# EAGLE board cloudArray2 (EAGLE 9.5.1), part 1 of 2
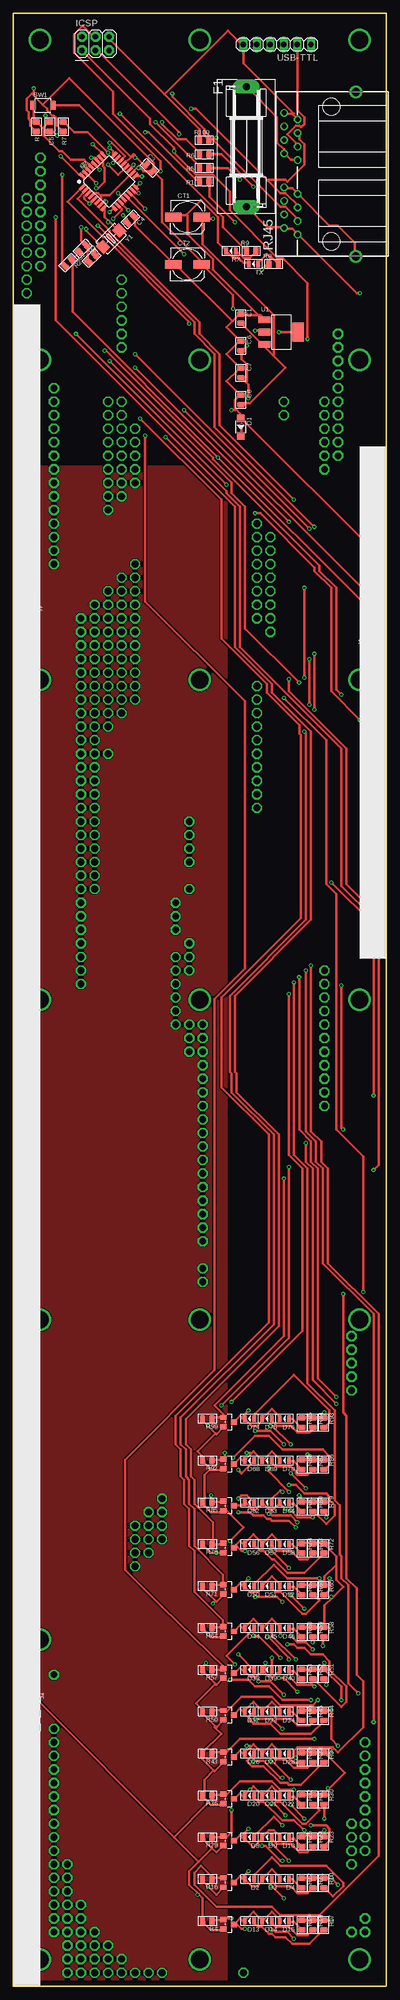
[diagram p13: board, top side]
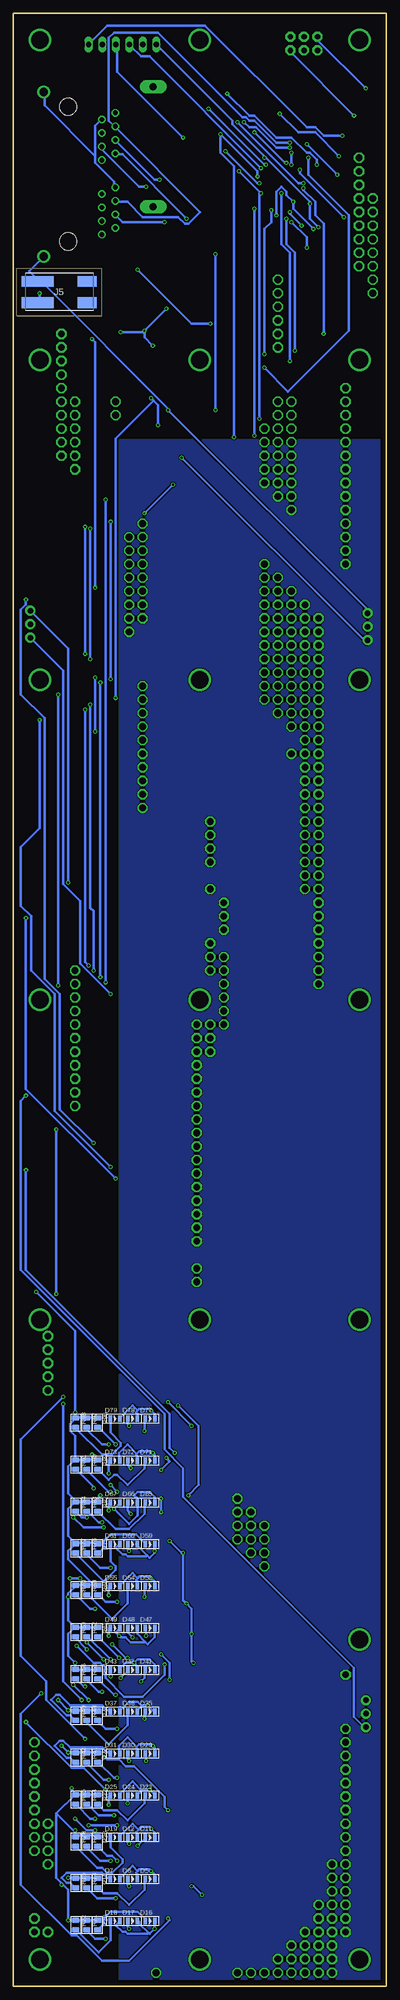
[diagram p14: board, bottom side, seen from below]

Size 70 x 370 mm. Coordinates in mm from the lower left corner, seen from the top.
Outline: 70,0 70,370 0,370 0,0 70,0
Copper layers (1*16): Top 0.035mm / dielectric 1.5mm / Bottom 0.035mm
Design rules "default *": minimum track width 6mil, minimum drill 0.35mm, track to track 6mil, track to pad 6mil, pad to pad 6mil, via to via 6mil, smd to smd 6mil, copper to edge 40mil, drill to drill 6mil, minimum pad ring 10mil, minimum via ring 8mil, stop-mask expansion 4mil, vias tented up to drill 14mil, thermal gap 10mil
Net classes: 0 default: width 0.508 mm

## Footprints (pad centres in the part's own frame; a part is rotated, then mirrored left to right if it is on the bottom)
C0805 = smd 1.397 x 1.016: 1 0,0.889; 2 0,-0.889
ELECTRO-SMD-C-6MM = smd 3.048 x 1.651: + 2.667,0; - -2.667,0
SOD-123 = smd 1.397 x 1.397: + -1.651,0; - 1.651,0
LED-0805 = smd 0.889 x 1.27: + -0.889,0; - 0.889,0
SH22,5A = drill 1.321 pad 2.54 long: 1 -11.252,0; 2 11.252,0
2X03 = drill 1.016 pad 1.88 octagon: 1 -2.54,-1.27; 2 -2.54,1.27; 3 0,-1.27; 4 0,1.27; 5 2.54,-1.27; 6 2.54,1.27
1X03 = drill 1.016 pad 1.88: 1 0,0; 2 2.54,0; 3 5.08,0
728340062 = smd 3.5 x 2: 1 -4.975,2; 3 -4.975,-2 | smd 6 x 2: 2 4.275,2; 4 4.275,-2
SOT-23 = smd 1.016 x 1.143: 1 -0.889,-1.016; 2 0.889,-1.016; 3 0,1.016
R0805 = smd 1.397 x 1.016: 1 0,0.889; 2 0,-0.889
557570-1 = drill 0.889: 1-1 -11.43,6.35; 1-2 -10.16,8.89; 1-3 -8.89,6.35; 1-4 -7.62,8.89; 1-5 -6.35,6.35; 1-6 -5.08,8.89; 1-7 -3.81,6.35; 1-8 -2.54,8.89; 2-1 2.54,6.35; 2-2 3.81,8.89; 2-3 5.08,6.35; 2-4 6.35,8.89; 2-5 7.62,6.35; 2-6 8.89,8.89; 2-7 10.16,6.35; 2-8 11.43,8.89 | drill 1.575 pad 2.184: G1 -15.494,-4.572; G3 15.367,-4.572 | hole 3.251: -12.7,0; 12.573,0
SW2-2.6-3.0X2.5X1.2+0.4MM = smd 1 x 1.7: 1 -1.9,0; 2 1.9,0
SOT-223 = smd 1.27 x 2.286: 1 -2.286,-3.175; 2 0,-3.175; 3 2.286,-3.175 | smd 3.556 x 2.159: TER 0,3.175
TQFP32-0.8-7X7MM = smd 1.27 x 0.559: 1 -4.293,2.8; 2 -4.293,2; 3 -4.293,1.2; 4 -4.293,0.4; 5 -4.293,-0.4; 6 -4.293,-1.2; 7 -4.293,-2; 8 -4.293,-2.8; 17 4.293,-2.8; 18 4.293,-2; 19 4.293,-1.2; 20 4.293,-0.4; 21 4.293,0.4; 22 4.293,1.2; 23 4.293,2; 24 4.293,2.8 | smd 0.559 x 1.27: 9 -2.8,-4.293; 10 -2,-4.293; 11 -1.2,-4.293; 12 -0.4,-4.293; 13 0.4,-4.293; 14 1.2,-4.293; 15 2,-4.293; 16 2.8,-4.293; 25 2.8,4.293; 26 2,4.293; 27 1.2,4.293; 28 0.4,4.293; 29 -0.4,4.293; 30 -1.2,4.293; 31 -2,4.293; 32 -2.8,4.293
1X06 = drill 1.016 long: 1 -6.35,0; 2 -3.81,0; 3 -1.27,0; 4 1.27,0; 5 3.81,0; 6 6.35,0
X2-SMD-5.0X3.2X1.3MM = smd 1.778 x 2.032: 1 -2.159,0; 2 2.159,0

## Placement (x,y rotation side)
C1  100nf  [C0805]  42.7,312.74 0 top
C2  18pf  [C0805]  14.71,324.05 135 top
C3  100nf  [C0805]  25.56,341 45 top
C4  18pf  [C0805]  22,331.35 315 top
C5  100nf  [C0805]  6.84,348.73 0 top
C6  100nf  [C0805]  42.7,307.66 0 top
C7  1uf  [C0805]  42.7,302.58 0 top
C8  1uf  [C0805]  42.7,297.5 0 top
CT1  220UF  [ELECTRO-SMD-C-6MM]  32.7,331.79 0 top
CT2  220UF  [ELECTRO-SMD-C-6MM]  32.7,322.9 0 top
D1  CESD5V0D1  [SOD-123]  42.7,292.42 270 top
D2  YELLOW-0805  [LED-0805]  44.29,20.07 180 top
D3  YELLOW-0805  [LED-0805]  47.59,20.07 180 top
D4  YELLOW-0805  [LED-0805]  50.89,20.07 180 top
D5  YELLOW-0805  [LED-0805]  44.29,20.07 0 bottom
D6  YELLOW-0805  [LED-0805]  47.59,20.07 0 bottom
D7  YELLOW-0805  [LED-0805]  50.89,20.07 0 bottom
D8  YELLOW-0805  [LED-0805]  44.29,27.92 180 top
D9  YELLOW-0805  [LED-0805]  47.59,27.92 180 top
D10  YELLOW-0805  [LED-0805]  50.89,27.92 180 top
D11  YELLOW-0805  [LED-0805]  44.29,27.92 0 bottom
D12  YELLOW-0805  [LED-0805]  47.59,27.92 0 bottom
D13  YELLOW-0805  [LED-0805]  44.29,12.22 180 top
D14  YELLOW-0805  [LED-0805]  47.59,12.22 180 top
D15  YELLOW-0805  [LED-0805]  50.89,12.22 180 top
D16  YELLOW-0805  [LED-0805]  44.29,12.22 0 bottom
D17  YELLOW-0805  [LED-0805]  47.59,12.22 0 bottom
D18  YELLOW-0805  [LED-0805]  50.89,12.22 0 bottom
D19  YELLOW-0805  [LED-0805]  50.89,27.92 0 bottom
D20  YELLOW-0805  [LED-0805]  44.29,35.77 180 top
D21  YELLOW-0805  [LED-0805]  47.59,35.77 180 top
D22  YELLOW-0805  [LED-0805]  50.89,35.77 180 top
D23  YELLOW-0805  [LED-0805]  44.29,35.77 0 bottom
D24  YELLOW-0805  [LED-0805]  47.59,35.77 0 bottom
D25  YELLOW-0805  [LED-0805]  50.89,35.77 0 bottom
D26  YELLOW-0805  [LED-0805]  44.29,43.62 180 top
D27  YELLOW-0805  [LED-0805]  47.59,43.62 180 top
D28  YELLOW-0805  [LED-0805]  50.89,43.62 180 top
D29  YELLOW-0805  [LED-0805]  44.29,43.62 0 bottom
D30  YELLOW-0805  [LED-0805]  47.59,43.62 0 bottom
D31  YELLOW-0805  [LED-0805]  50.89,43.62 0 bottom
D32  YELLOW-0805  [LED-0805]  44.29,51.47 180 top
D33  YELLOW-0805  [LED-0805]  47.59,51.47 180 top
D34  YELLOW-0805  [LED-0805]  50.89,51.47 180 top
D35  YELLOW-0805  [LED-0805]  44.29,51.47 0 bottom
D36  YELLOW-0805  [LED-0805]  47.59,51.47 0 bottom
D37  YELLOW-0805  [LED-0805]  50.89,51.47 0 bottom
D38  YELLOW-0805  [LED-0805]  44.29,59.32 180 top
D39  YELLOW-0805  [LED-0805]  47.59,59.32 180 top
D40  YELLOW-0805  [LED-0805]  50.89,59.32 180 top
D41  YELLOW-0805  [LED-0805]  44.29,59.32 0 bottom
D42  YELLOW-0805  [LED-0805]  47.59,59.32 0 bottom
D43  YELLOW-0805  [LED-0805]  50.89,59.32 0 bottom
D44  YELLOW-0805  [LED-0805]  44.29,67.17 180 top
D45  YELLOW-0805  [LED-0805]  47.59,67.17 180 top
D46  YELLOW-0805  [LED-0805]  50.89,67.17 180 top
D47  YELLOW-0805  [LED-0805]  44.29,67.17 0 bottom
D48  YELLOW-0805  [LED-0805]  47.59,67.17 0 bottom
D49  YELLOW-0805  [LED-0805]  50.89,67.17 0 bottom
D50  YELLOW-0805  [LED-0805]  44.29,75.02 180 top
D51  YELLOW-0805  [LED-0805]  47.59,75.02 180 top
D52  YELLOW-0805  [LED-0805]  50.89,75.02 180 top
D53  YELLOW-0805  [LED-0805]  44.29,75.02 0 bottom
D54  YELLOW-0805  [LED-0805]  47.59,75.02 0 bottom
D55  YELLOW-0805  [LED-0805]  50.89,75.02 0 bottom
D56  YELLOW-0805  [LED-0805]  44.29,82.87 180 top
D57  YELLOW-0805  [LED-0805]  47.59,82.87 180 top
D58  YELLOW-0805  [LED-0805]  50.89,82.87 180 top
D59  YELLOW-0805  [LED-0805]  44.29,82.87 0 bottom
D60  YELLOW-0805  [LED-0805]  47.59,82.87 0 bottom
D61  YELLOW-0805  [LED-0805]  50.89,82.87 0 bottom
D62  YELLOW-0805  [LED-0805]  44.29,90.72 180 top
D63  YELLOW-0805  [LED-0805]  47.59,90.72 180 top
D64  YELLOW-0805  [LED-0805]  50.89,90.72 180 top
D65  YELLOW-0805  [LED-0805]  44.29,90.72 0 bottom
D66  YELLOW-0805  [LED-0805]  47.59,90.72 0 bottom
D67  YELLOW-0805  [LED-0805]  50.89,90.72 0 bottom
D68  YELLOW-0805  [LED-0805]  44.29,98.57 180 top
D69  YELLOW-0805  [LED-0805]  47.59,98.57 180 top
D70  YELLOW-0805  [LED-0805]  50.89,98.57 180 top
D71  YELLOW-0805  [LED-0805]  44.29,98.57 0 bottom
D72  YELLOW-0805  [LED-0805]  47.59,98.57 0 bottom
D73  YELLOW-0805  [LED-0805]  50.89,98.57 0 bottom
D74  YELLOW-0805  [LED-0805]  44.29,106.42 180 top
D75  YELLOW-0805  [LED-0805]  47.59,106.42 180 top
D76  YELLOW-0805  [LED-0805]  50.89,106.42 180 top
D77  YELLOW-0805  [LED-0805]  44.29,106.42 0 bottom
D78  YELLOW-0805  [LED-0805]  47.59,106.42 0 bottom
D79  YELLOW-0805  [LED-0805]  50.89,106.42 0 bottom
F1  [SH22,5A]  43.73,345 270 top
ICSP  [2X03]  15.44,364.34 0 top
J2  455-1750-1-ND  [1X03]  66.82,252.89 90 top
J3  455-1750-1-ND  [1X03]  3.48,257.5 270 top
J4  455-1750-1-ND  [1X03]  3.8,53.64 270 top
J5  7-2834006-2  [728340062]  61.12,317.74 180 bottom
Q1  2N7002  [SOT-23]  40.42,19.44 270 top
Q2  2N7002  [SOT-23]  40.42,11.59 270 top
Q3  2N7002  [SOT-23]  40.42,27.29 270 top
Q4  2N7002  [SOT-23]  40.42,35.14 270 top
Q5  2N7002  [SOT-23]  40.42,42.99 270 top
Q6  2N7002  [SOT-23]  40.42,50.84 270 top
Q7  2N7002  [SOT-23]  40.42,58.69 270 top
Q8  2N7002  [SOT-23]  40.42,66.54 270 top
Q9  2N7002  [SOT-23]  40.42,74.39 270 top
Q10  2N7002  [SOT-23]  40.42,82.24 270 top
Q11  2N7002  [SOT-23]  40.42,90.09 270 top
Q12  2N7002  [SOT-23]  40.42,97.94 270 top
Q13  2N7002  [SOT-23]  40.42,105.79 270 top
R  10K  [R0805]  4.3,348.73 0 top
R1  100  [R0805]  35.88,338.46 270 top
R2  200  [R0805]  10.32,323.22 315 top
R3  300  [R0805]  13.01,325.91 315 top
R4  4.7K  [R0805]  36.44,12.22 270 top
R5  100  [R0805]  35.88,341 270 top
R6  100  [R0805]  35.88,343.54 270 top
R7  100  [R0805]  9.38,348.73 0 top
R8  470  [R0805]  48.86,322.99 90 top
R9  470  [R0805]  44.64,325.44 90 top
R10  470  [R0805]  58.26,19.31 0 top
R11  470  [R0805]  56.23,19.31 0 top
R12  470  [R0805]  54.2,19.31 0 top
R13  270  [R0805]  54.2,19.31 0 bottom
R14  270  [R0805]  56.23,19.31 0 bottom
R15  270  [R0805]  58.26,19.31 0 bottom
R16  4.7K  [R0805]  36.44,20.07 270 top
R17  470  [R0805]  58.26,11.46 0 top
R18  470  [R0805]  56.23,11.46 0 top
R19  470  [R0805]  54.2,11.46 0 top
R20  270  [R0805]  54.2,11.46 0 bottom
R21  270  [R0805]  56.23,11.46 0 bottom
R22  270  [R0805]  58.26,11.46 0 bottom
R23  470  [R0805]  58.26,27.16 0 top
R24  470  [R0805]  56.23,27.16 0 top
R25  470  [R0805]  54.2,27.16 0 top
R26  270  [R0805]  54.2,27.16 0 bottom
R27  270  [R0805]  56.23,27.16 0 bottom
R28  270  [R0805]  58.26,27.16 0 bottom
R29  4.7K  [R0805]  36.44,27.92 270 top
R30  470  [R0805]  58.26,35.01 0 top
R31  470  [R0805]  56.23,35.01 0 top
R32  470  [R0805]  54.2,35.01 0 top
R33  270  [R0805]  54.2,35.01 0 bottom
R34  270  [R0805]  56.23,35.01 0 bottom
R35  270  [R0805]  58.26,35.01 0 bottom
R36  4.7K  [R0805]  36.44,35.77 270 top
R37  470  [R0805]  58.26,42.86 0 top
R38  470  [R0805]  56.23,42.86 0 top
R39  470  [R0805]  54.2,42.86 0 top
R40  270  [R0805]  54.2,42.86 0 bottom
R41  270  [R0805]  56.23,42.86 0 bottom
R42  270  [R0805]  58.26,42.86 0 bottom
R43  4.7K  [R0805]  36.44,43.62 270 top
R44  470  [R0805]  58.26,50.71 0 top
R45  470  [R0805]  56.23,50.71 0 top
R46  470  [R0805]  54.2,50.71 0 top
R47  270  [R0805]  54.2,50.71 0 bottom
R48  270  [R0805]  56.23,50.71 0 bottom
R49  270  [R0805]  58.26,50.71 0 bottom
R50  4.7K  [R0805]  36.44,51.47 270 top
R51  470  [R0805]  58.26,58.56 0 top
R52  470  [R0805]  56.23,58.56 0 top
R53  470  [R0805]  54.2,58.56 0 top
R54  270  [R0805]  54.2,58.56 0 bottom
R55  270  [R0805]  56.23,58.56 0 bottom
R56  270  [R0805]  58.26,58.56 0 bottom
R57  4.7K  [R0805]  36.44,59.32 270 top
R58  470  [R0805]  58.26,66.41 0 top
R59  470  [R0805]  56.23,66.41 0 top
R60  470  [R0805]  54.2,66.41 0 top
R61  270  [R0805]  54.2,66.41 0 bottom
R62  270  [R0805]  56.23,66.41 0 bottom
R63  270  [R0805]  58.26,66.41 0 bottom
R64  4.7K  [R0805]  36.44,67.17 270 top
R65  470  [R0805]  58.26,74.26 0 top
R66  470  [R0805]  56.23,74.26 0 top
R67  470  [R0805]  54.2,74.26 0 top
R68  270  [R0805]  54.2,74.26 0 bottom
R69  270  [R0805]  56.23,74.26 0 bottom
R70  270  [R0805]  58.26,74.26 0 bottom
R71  4.7K  [R0805]  36.44,75.02 270 top
R72  470  [R0805]  58.26,82.11 0 top
R73  470  [R0805]  56.23,82.11 0 top
R74  470  [R0805]  54.2,82.11 0 top
R75  270  [R0805]  54.2,82.11 0 bottom
R76  270  [R0805]  56.23,82.11 0 bottom
R77  270  [R0805]  58.26,82.11 0 bottom
R78  4.7K  [R0805]  36.44,82.87 270 top
R79  470  [R0805]  58.26,89.96 0 top
R80  470  [R0805]  56.23,89.96 0 top
R81  470  [R0805]  54.2,89.96 0 top
R82  270  [R0805]  54.2,89.96 0 bottom
R83  270  [R0805]  56.23,89.96 0 bottom
R84  270  [R0805]  58.26,89.96 0 bottom
R85  4.7K  [R0805]  36.44,90.72 270 top
R86  470  [R0805]  58.26,97.81 0 top
R87  470  [R0805]  56.23,97.81 0 top
R88  470  [R0805]  54.2,97.81 0 top
R89  270  [R0805]  54.2,97.81 0 bottom
R90  270  [R0805]  56.23,97.81 0 bottom
R91  270  [R0805]  58.26,97.81 0 bottom
R92  4.7K  [R0805]  36.44,98.57 270 top
R93  470  [R0805]  58.26,105.66 0 top
R94  470  [R0805]  56.23,105.66 0 top
R95  470  [R0805]  54.2,105.66 0 top
R96  270  [R0805]  54.2,105.66 0 bottom
R97  270  [R0805]  56.23,105.66 0 bottom
R98  270  [R0805]  58.26,105.66 0 bottom
R99  4.7K  [R0805]  36.44,106.42 270 top
R100  22k  [R0805]  35.88,346.2 90 top
RJ45  [557570-1]  59.72,339.92 90 top
RX  YELLOW-0805  [LED-0805]  40.83,325.44 180 top
SW1  B3U-1000P-2P-SMD  [SW2-2.6-3.0X2.5X1.2+0.4MM]  5.56,352.75 0 top
TX  YELLOW-0805  [LED-0805]  45.05,322.99 180 top
U1  CJT1117-5.0-SOT223  [SOT-223]  50.32,310.2 270 top
U2  ATMEGA328P-AU-TQFP32  [TQFP32-0.8-7X7MM]  17.94,338.46 45 top
USB-TTL  [1X06]  49.51,364.16 180 top
Y1  16MHZ  [X2-SMD-5.0X3.2X1.3MM]  18.35,327.75 225 top

## Tracks (layer width: path | path; a pad name or v marks a point on that pad's centre or on a via)
9V  (via drill 0.35)
  Top 0.508: RJ45.2-1 53.34,342.58 52.07,342.58 51.12,343.54 RJ45.2-2 50.8,343.85 50.8,344.49 49.53,345.76 49.53,350.52 43.81,356.24 F1.1 | 46.99,307.66 48.74,305.91 | 48.74,305.91 51.12,303.53 44.45,296.86 42.86,296.86 C8.2 | 46.99,307.66 42.86,311.79 C1.2 | 46.99,307.66 U1.3 | 35.56,331.47 35.56,326.71 48.9,313.37 48.9,306.07 48.74,305.91 | 35.56,331.47 35.56,331.79 CT1.+ 35.56,331.47 | 35.56,331.47 v37.47,331.47
  Bottom 0.508: v37.47,331.47 49.53,343.54 50.8,343.54 RJ45.2-2
9VSUPPLY  (via drill 0.35)
  Top 0.508: F1.2 43.81,333.69 47.62,329.88 50.8,329.88 RJ45.1-2 51.12,329.56 52.39,329.56 53.34,328.61 RJ45.1-1 53.66,328.3 64.45,317.5 v65.09,317.5
  Bottom 0.508: v65.09,317.5 65.09,315.91 J5.2
+5V  (via drill 0.35)
  Top 0.508: R46.1 54.29,51.75 56.2,51.75 R45.1 56.52,51.75 58.1,51.75 R49.1 58.42,51.75 v59.69,51.75 59.69,46.35 v60.96,45.09 | R32.1 54.29,35.88 56.2,35.88 R31.1 56.52,35.88 58.1,35.88 R35.1 58.42,36.2 59.21,36.99 | R39.1 54.29,43.81 56.2,43.81 R38.1 56.52,43.81 58.1,43.81 R42.1 58.42,43.81 59.05,43.18 | 59.21,36.99 62.23,40.01 59.05,43.18 | 59.05,43.18 v59.69,43.81 | R12.1 54.29,20.32 56.2,20.32 R11.1 56.52,20.32 58.1,20.32 R15.1 58.42,20.32 v59.69,20.32 v60.96,19.05 | R19.1 54.29,12.38 56.2,12.38 R18.1 56.52,12.38 58.1,12.38 R22.1 58.42,12.38 v59.69,12.38 | R25.1 54.29,28.26 56.2,28.26 R24.1 56.52,28.26 58.1,28.26 R28.1 58.42,28.26 v58.42,29.21 | v59.05,37.15 59.21,36.99 | R67.1 54.29,75.25 56.2,75.25 R66.1 56.52,75.25 58.1,75.25 R70.1 58.42,75.25 58.42,76.83 60.64,79.06 | R60.1 54.29,67.31 56.2,67.31 R59.1 56.52,67.31 58.1,67.31 R63.1 58.42,67.31 58.42,71.44 59.85,72.87 | R74.1 54.29,83.19 56.2,83.19 R73.1 56.52,83.19 58.1,83.19 R77.1 58.42,82.87 60.64,80.64 60.64,79.06 | 59.85,72.87 61.91,74.93 60.64,76.2 60.64,79.06 | 55.24,98.74 56.2,98.74 R87.1 56.52,98.74 58.1,98.74 R91.1 | 55.24,98.74 54.29,98.74 R88.1 | v55.24,99.69 55.24,98.74 | R95.1 54.29,106.68 56.2,106.68 R94.1 56.52,106.68 58.1,106.68 R98.1 58.42,106.68 v58.42,107.63 | R84.1 58.1,90.81 56.52,90.81 R80.1 56.2,90.81 54.29,90.81 R81.1 53.98,91.12 53.98,91.76 v53.66,92.08 | R53.1 54.29,59.37 56.2,59.37 R52.1 56.52,59.37 58.1,59.37 R56.1 | v58.42,60.64 58.42,59.69 R56.1 | v59.69,73.03 59.85,72.87 | v61.59,53.66 61.59,56.2 58.42,59.37 R56.1 | v42.86,292.74 42.86,290.83 D1.- | v44.13,297.81 44.13,300.36 43.66,300.83
  Top 0.508: 43.66,300.83 42.86,301.62 C7.2 | 42.86,306.7 42.86,305.12 43.81,304.17 43.81,300.99 43.66,300.83 | v45.4,310.51 46.99,310.51 U1.2 | 42.86,306.7 v43.81,307.66 | 42.86,306.7 C6.2 | v49.85,310.2 53.34,310.2 U1.TER | 5.56,352.9 6.35,352.11 6.35,351.79 7.3,350.84 7.62,350.84 8.26,350.2 8.26,348.93 9.21,347.98 R7.2 | 5.56,352.9 3.65,354.81 | 3.65,354.81 3.49,354.96 2.54,354.01 2.54,351.79 2.86,351.47 2.86,350.2 3.17,349.88 3.17,348.93 4.13,347.98 R.2 | v3.81,355.92 3.81,354.96 3.65,354.81 | 16.35,335.76 15.88,336.23 15.24,336.23 14.92,335.92 U2.4 | 16.35,335.76 16.51,335.6 16.51,335.28 15.88,334.64 U2.6 | 23.34,341.15 23.5,341.31 24.45,340.36 26.04,340.36 C3.2 | 23.34,341.15 22.54,340.36 U2.18 22.23,340.04 18.1,335.92 16.51,335.92 16.35,335.76 | C3.2 26.35,340.36 27.94,338.77 27.94,330.83 35.24,323.53 35.24,323.21 CT2.+ 35.56,322.9 41.27,317.18 v41.27,314.64 | v23.5,341 23.34,341.15 | 5.56,352.9 10.48,357.82 26.35,341.95 26.35,340.68 C3.2 | v65.72,130.18 65.72,155.57 60.64,160.66 60.64,204.79 58.74,206.69 58.74,233.68 v50.8,241.62
  Bottom 0.508: R46.1 54.29,51.75 56.2,51.75 R45.1 56.52,51.75 58.1,51.75 R49.1 58.42,51.75 v59.69,51.75 v61.59,53.66 | R39.1 54.29,43.81 56.2,43.81 R38.1 56.52,43.81 58.1,43.81 R42.1 58.42,43.81 v59.69,43.81 v60.96,45.09 | R12.1 54.29,20.32 56.2,20.32 R11.1 56.52,20.32 58.1,20.32 R15.1 58.42,20.32 v59.69,20.32 | R19.1 54.29,12.38 56.2,12.38 R18.1 56.52,12.38 58.1,12.38 R22.1 58.42,12.38 v59.69,12.38 59.69,18.1 60.8,19.21 | R32.1 54.29,35.88 56.2,35.88 R31.1 56.52,35.88 58.1,35.88 R35.1 | R25.1 54.29,28.26 56.2,28.26 R24.1 56.52,28.26 58.1,28.26 R28.1 58.42,28.26 58.42,28.89 | 58.42,28.89 61.75,32.23 | 61.75,32.23 61.91,32.38 58.42,35.88 R35.1 | 58.42,28.89 v58.42,29.21 | 60.8,19.21 61.91,20.32 61.91,32.07 61.75,32.23 | v60.96,19.05 60.8,19.21 | v59.05,37.15 59.05,36.83 58.42,36.2 R35.1 | 55.24,98.74 56.2,98.74 R87.1 56.52,98.74 58.1,98.74 R91.1 | 55.24,98.74 54.29,98.74 R88.1 | 55.24,98.74 v55.24,99.69 | R95.1 54.29,106.68 56.2,106.68 R94.1 56.52,106.68 58.1,106.68 R98.1 | R98.1 58.42,106.68 v58.42,107.63 58.42,122.87 v65.72,130.18 | R91.1 58.42,98.74 58.42,103.19 59.37,104.14 59.37,105.41 58.42,106.36 R98.1 | R84.1 58.1,90.81 56.52,90.81 R80.1 56.2,90.81 54.29,90.81 R81.1 53.98,91.12 54.29,91.44 v53.66,92.08 | R74.1 54.29,83.19 56.2,83.19 R73.1 56.52,83.19 58.1,83.19 R77.1 | 54.93,75.25 56.2,75.25 R66.1 56.52,75.25 58.1,75.25 R70.1 58.42,74.93 59.69,73.66 v59.69,73.03 59.69,68.58 58.42,67.31 R63.1 | 54.93,75.25 54.29,75.25 R67.1 | R60.1 54.29,67.31 56.2,67.31 R59.1 56.52,67.31 58.1,67.31 R63.1 | R53.1 54.29,59.37 56.2,59.37 R52.1 56.52,59.37 58.1,59.37 R56.1 58.42,59.69 v58.42,60.64 59.69,61.91 59.69,66.04 58.74,66.99 58.42,66.99 R63.1
  Bottom 0.508: 54.93,75.25 59.69,80.01 59.69,81.6 58.42,82.87 R77.1 | R84.1 58.42,90.81 59.69,89.53 59.69,84.45 58.42,83.19 R77.1 | R91.1 58.42,98.42 58.74,98.42 59.69,97.47 59.69,92.39 58.42,91.12 R84.1 | v42.86,292.74 42.86,296.55 43.66,297.34 | v44.13,297.81 43.66,297.34 | 45.4,310.2 45.4,309.25 v43.81,307.66 | 45.4,310.2 v49.85,310.2 | 45.4,310.2 v45.4,310.51 v41.27,314.64 | v3.81,355.92 12.7,364.81 12.7,365.44 ICSP.2 | v23.5,341 44.45,361.95 46.04,361.95 47.94,363.86 USB-TTL.4 | v50.8,241.62 50.8,290.19 43.66,297.34
A0  (via drill 0.35)
  Top 0.508: v18.73,341.95 19.68,342.9 U2.23 | v24.77,347.66 25.4,347.66 34.29,338.77 34.92,338.77 R1.2
  Bottom 0.508: v18.73,341.95 19.05,341.95 v24.77,347.66
A1  (via drill 0.35)
  Top 0.508: v18.1,344.81 18.73,344.17 18.73,343.54 U2.24 | v26.67,349.57 34.92,341.31 R5.2
  Bottom 0.508: v18.1,344.81 20.64,344.81 24.45,348.62 25.72,348.62 v26.67,349.57
AREF  (via drill 0.35)
  Top 0.508: v17.78,341.63 19.68,339.73 20.95,341 U2.20 | v17.78,343.85 13.97,347.66 11.43,347.66 9.53,349.57 R7.1
  Bottom 0.508: v17.78,343.85 v17.78,341.63
AUX1  (via drill 0.35)
  Top 0.508: v22.54,341.63 22.54,341.31 21.91,340.68 U2.19 | v33.34,352.11 34.29,352.11 47.78,338.61 | 47.78,338.61 50.16,336.23 51.12,336.23 53.66,333.69 RJ45.1-5 | RJ45.2-5 53.66,347.35 53.66,346.39 54.61,345.44 54.61,341.63 51.44,338.45 51.12,338.77 47.94,338.77 47.78,338.61
  Bottom 0.508: v22.54,341.63 22.86,341.63 v33.34,352.11
AUX2  (via drill 0.35)
  Top 0.508: v18.1,345.76 18.41,345.76 20.95,343.22 20.32,342.58 U2.22
  Bottom 0.508: v18.1,345.76 20.64,345.76 24.77,349.88 25.72,349.88 26.35,350.52 26.99,350.52 42.86,366.39 51.12,366.39 52.07,365.44 52.07,349.88 51.12,348.93 RJ45.2-6 50.8,348.62 34.92,332.74 37.15,330.52 37.78,330.52 39.05,331.79 45.72,331.79 48.58,334.64 50.8,334.64 RJ45.1-6
BCOPPER
  pour Bottom: 50,0 50,290 0,290 0,0
GND  (via drill 0.35)
  Top 0.508: Q10.2 39.37,81.28 v38.1,81.28 37.15,81.28 R78.2 | Q8.2 39.37,65.41 37.15,65.41 v36.51,66.04 35.88,66.67 35.88,66.99 35.56,67.31 R64.2 | 37.94,72.23 35.24,74.93 R71.2 | 37.94,72.23 38.1,72.07 39.37,73.34 Q9.2 | 37.94,72.23 v37.47,71.75 | 37.94,103.66 v36.51,105.09 35.24,106.36 R99.2 | 37.94,103.66 38.1,103.5 39.37,104.78 Q13.2 | 36.99,97 35.88,98.11 35.88,98.42 35.56,98.74 | 36.99,97 37.15,96.84 39.37,96.84 Q12.2 | 36.99,97 35.88,95.89 35.88,90.81 R85.2 35.56,90.81 35.88,90.49 35.88,90.17 37.15,88.9 39.37,88.9 Q11.2 39.69,89.22 40.01,89.22 43.18,86.04 v40.64,83.5 | 37.94,103.66 34.61,100.33 35.56,99.38 35.56,98.74 | 35.56,98.74 R92.2 | 36.67,34.45 35.88,35.24 35.88,35.56 35.56,35.88 R36.2 35.88,35.88 35.88,38.73 37.62,40.48 | 36.67,34.45 37.15,33.97 39.37,33.97 Q4.2 | 37.62,40.48 35.56,42.55 35.56,43.5 R43.2 35.56,43.81 39.05,47.31 37.78,48.58 37.94,48.74 | 37.62,40.48 37.78,40.32 39.37,41.91 Q5.2 | 37.94,56.67 35.88,58.74 35.88,59.05 35.56,59.37 | 37.94,56.67 38.1,56.52 39.37,57.78 Q7.2 | 37.94,48.74 35.24,51.44 R50.2 35.56,51.75 34.29,53.02 37.94,56.67 | 37.94,48.74 38.1,48.58 39.37,49.85 Q6.2 | Q1.2 39.37,18.41 38.1,17.14 v36.51,18.73 35.24,20 R16.2 | 35.56,12.38 35.88,12.06 35.88,11.75 37.15,10.48 39.37,10.48 Q2.2 | 37.31,25.88 35.88,27.3 35.88,27.62 35.56,27.94 R29.2 | 37.31,25.88 38.1,25.08 39.37,26.35 Q3.2 | 35.56,12.38 35.56,16.51 34.77,17.3 | 34.77,17.3 33.02,19.05 33.02,21.59 34.77,23.34 | 37.31,25.88 34.77,23.34 | 35.56,12.38 R4.2 | v34.61,17.14 34.77,17.3 | 34.77,23.34 30.16,27.94 | 30.16,27.94 4.45,53.66 3.81,53.66 J4.1 | 30.16,27.94 36.67,34.45 | v36.2,60.64 35.24,59.69 35.56,59.37
  Top 0.508: 35.56,59.37 R57.2 | 28.42,354.81 17.78,365.44 ICSP.6 | 28.42,354.81 34.92,348.3 34.92,346.39 R100.1 | 22.07,343.06 22.54,343.54 23.02,343.06 | 22.07,343.06 20.95,341.95 U2.21 | 23.02,343.06 24.77,341.31 C3.1 | 22.07,343.06 12.38,352.74 7.62,352.74 SW1.2 | U2.5 14.92,334.96 v14.29,334.33 13.34,335.28 13.34,335.6 13.97,336.23 U2.3 | C2.1 13.97,323.53 13.97,326.07 13.65,326.39 R3.1 13.34,326.71 12.7,327.34 v12.7,329.88 | RJ45.1-8 51.12,337.19 52.39,337.19 53.34,336.23 RJ45.1-7 53.66,335.92 59.37,330.2 60.96,330.2 64.14,327.02 64.14,324.49 RJ45.G1 | 52.55,351 53.34,350.2 RJ45.2-7 | 52.55,351 52.39,351.15 51.12,351.15 RJ45.2-8 | 52.55,351 52.7,351.15 43.18,360.68 43.18,363.86 USB-TTL.6 42.86,364.17 40.32,366.71 28.42,354.81 | v22.86,342.9 23.02,343.06 | TX.- 44.13,323.21 43.18,323.21 42.23,324.17 41.27,324.17 40.01,325.44 RX.- 39.69,325.75 38.42,327.02 38.42,331.79 35.24,334.96 32.54,332.26 | 32.54,332.26 32.38,332.11 30.16,332.11 CT1.- | C4.1 22.86,331.79 22.86,330.2 29.84,323.21 CT2.- 30.16,322.9 30.48,322.9 41.12,312.26 | 46.04,313.37 46.35,313.37 46.99,312.74 U1.1 | 46.04,313.37 42.86,313.37 C1.1 42.55,313.37 42.23,313.37 41.12,312.26 | 41.75,295.75 41.59,295.91 41.59,297.5 42.55,298.45 | 41.75,295.75 42.55,294.96 42.55,294.32 D1.+ 42.86,294 68.58,268.29 68.58,254.63 66.99,253.05 J2.1 | 42.55,298.45 40.01,300.99 42.23,303.21 42.55,303.21 C7.1 42.55,303.53 40.01,306.07 42.23,308.29 42.55,308.29 C6.1 42.55,308.61 40.01,311.15 41.12,312.26 | 42.55,298.45 C8.1 | v40.96,295.59 41.59,295.59 41.75,295.75 | 46.04,313.37 37.47,321.94 37.47,323.85 32.7,328.61 32.7,332.11 32.54,332.26
  Top 0.508: v40.96,109.54 54.29,122.87 54.29,153.35 51.75,155.89 v51.75,186.06
  Bottom 0.508: v40.64,83.5 38.42,81.28 v38.1,81.28 38.1,72.39 v37.47,71.75 36.51,70.8 v36.51,66.04 36.51,60.96 v36.2,60.64 | v36.51,18.73 36.2,18.73 v34.61,17.14 | RJ45.G1 64.45,324.17 66.99,321.63 65.41,320.04 J5.4 65.09,319.72 64.77,319.72 40.64,295.59 v40.96,295.59 3.49,258.13 3.49,257.81 J3.1 | v12.7,329.88 14.29,331.47 v14.29,334.33 14.29,334.64 22.7,343.06 | 54.61,343.22 54.61,348.93 53.66,349.88 RJ45.2-7 | 54.61,343.22 54.61,341.95 51.12,338.45 51.12,337.5 RJ45.1-8 | 54.61,343.22 64.14,352.74 64.14,355.28 RJ45.G3 | 22.7,343.06 28.89,349.25 28.89,349.88 42.86,363.86 USB-TTL.6 | v22.86,342.9 22.7,343.06 | v40.96,109.54 v36.51,105.09 | v51.75,186.06 57.47,191.77 57.47,203.52 60.64,206.69 60.64,246.7 66.67,252.73 J2.1
GREEN  (via drill 0.35)
  Top 0.508: v8.26,347.03 7.62,347.66 6.99,347.66 C5.2
  Bottom 0.508: v8.26,347.03 11.75,347.03 13.34,348.62 14.92,348.62 33.97,367.67 52.39,367.67 55.88,364.17 USB-TTL.1
LED1  (via drill 0.35)
  Top 0.508: R4.1 37.47,12.38 39.37,12.38 Q2.1 39.69,12.7 v40.96,12.7 | v52.7,278.76 38.73,292.74 38.73,306.07 34.92,309.88 34.92,312.1 18.1,328.93 18.1,329.25 12.06,335.28 13.34,336.55 U2.2 | v52.7,188.28 52.7,155.89 55.24,153.35 55.24,113.03 60.33,107.95 60.33,91.12 61.28,90.17 61.28,80.96 61.59,80.64 61.59,76.52 62.87,75.25 62.87,56.83 v64.77,54.93
  Bottom 0.508: v52.7,188.28 v52.7,278.76 | v64.77,54.93 68.58,51.12 68.58,19.05 59.05,9.53 58.1,9.53 53.34,4.76 48.26,4.76 40.64,12.38 v40.96,12.7
LED2  (via drill 0.35)
  Top 0.508: 37.47,20.32 39.37,20.32 Q1.1 | v18.1,332.74 18.73,333.38 U2.9 | v15.88,330.2 33.97,312.1 33.97,309.88 37.78,306.07 37.78,292.42 v56.52,273.69 | v56.52,239.4 v56.52,249.87 | v55.88,191.45 55.88,160.34 57.78,158.43 57.78,154.62 59.05,153.35 59.05,135.57 68.58,126.05 68.58,24.45 57.47,13.34 50.16,13.34 48.58,14.92 38.1,14.92 33.97,19.05 33.97,21.27 35.24,22.54 37.47,20.32 | 37.47,20.32 R16.1
  Bottom 0.508: v18.1,332.74 18.1,332.42 v15.88,330.2 | v56.52,249.87 v56.52,273.69 | v56.52,239.4 56.52,192.09 v55.88,191.45
LED3  (via drill 0.35)
  Top 0.508: R29.1 37.47,27.94 39.37,27.94 Q3.1 39.69,28.26 40.01,27.94 40.96,28.89 v40.96,33.02 | v18.73,331.47 20.32,333.06 20.32,333.38 19.68,334.01 U2.10 | v17.14,306.7 17.46,306.7 37.47,286.7 37.47,286.38 57.47,266.38 57.47,265.43 60.64,262.25 60.64,243.21 v61.59,242.25 | v61.59,187.64 61.59,160.97 v61.91,160.66 | v61.91,129.86 61.91,107.63 62.55,107 62.55,76.52 64.45,74.61 64.45,58.42 65.72,57.15 65.72,48.58 60.96,43.81 60.01,44.77 53.34,44.77 52.7,44.13 52.7,43.18 v53.02,42.86
  Bottom 0.508: v18.73,331.47 18.73,326.71 17.14,325.12 v17.14,306.7 | v61.59,187.64 v61.59,242.25 | v61.91,129.86 v61.91,160.66 | v53.02,42.86 52.7,42.86 52.39,42.55 50.16,42.55 48.9,41.27 47.31,41.27 41.59,35.56 41.59,33.66 v40.96,33.02
LED4  (via drill 0.35)
  Top 0.508: R36.1 37.47,35.88 39.37,35.88 Q4.1 39.69,36.2 40.01,35.88 42.55,38.42 48.58,38.42 50.16,36.83 v52.7,36.83 | v21.59,333.06 20.32,334.33 U2.11 | v55.56,273.37 v22.86,306.07 | v55.56,240.35 v55.56,248.92 | v54.93,190.5 54.93,160.34 56.83,158.43 56.83,154.62 58.1,153.35 58.1,135.57 67.63,126.05 v67.63,49.53
  Bottom 0.508: v21.59,333.06 21.59,330.83 22.86,329.56 v22.86,306.07 | v55.56,248.92 v55.56,273.37 | v55.56,240.35 55.56,202.25 54.93,201.61 v54.93,190.5 | v67.63,49.53 59.05,40.96 56.83,40.96 v52.7,36.83
LED5  (via drill 0.35)
  Top 0.508: R43.1 37.47,43.81 39.37,43.81 Q5.1 39.69,44.13 40.01,43.81 42.55,46.35 v56.52,46.35 | v19.68,336.23 20.64,335.28 U2.12 | v18.1,304.8 40.96,281.94 40.96,280.04 43.5,277.5 43.5,254.63 v53.66,244.47 | v53.66,189.23 53.66,160.66 55.88,158.43 55.88,154.62 57.15,153.35 57.15,113.98 v60.64,110.49
  Bottom 0.508: v19.68,336.23 19.68,326.71 18.1,325.12 v18.1,304.8 | v53.66,189.23 v53.66,244.47 | v60.64,110.49 68.58,102.55 68.58,61.91 63.82,57.15 63.82,53.66 v56.52,46.35
LED6  (via drill 0.35)
  Top 0.508: R50.1 37.47,51.75 39.37,51.75 Q6.1 39.69,51.75 40.01,51.44 42.86,54.29 48.58,54.29 50.16,52.7 56.2,52.7 v57.15,53.66 | v32.07,324.8 21.27,335.6 U2.13 | v67.63,260.03 v32.07,295.59 | v54.93,158.12 54.93,154.62 56.2,153.35 56.2,113.67 v60.64,109.22
  Bottom 0.508: v32.07,295.59 v32.07,324.8 | v67.63,260.03 67.63,259.08 68.58,258.13 68.58,242.25 64.14,237.81 64.14,188.91 61.28,186.06 61.28,164.47 v54.93,158.12 | v60.64,109.22 60.64,57.15 v57.15,53.66
LED7  (via drill 0.35)
  Top 0.508: R57.1 37.47,59.37 39.37,59.37 Q7.1 39.69,59.69 27.94,71.12 20.95,78.11 20.95,98.74 37.78,115.57 37.78,185.1 43.5,190.82 43.5,240.98 24.77,259.71 v24.77,290.83 | v24.77,333.38 21.91,336.23 U2.14
  Bottom 0.508: v24.77,290.83 v24.77,333.38
LED8  (via drill 0.35)
  Top 0.508: R64.1 37.47,67.31 39.37,67.31 Q8.1 39.37,67.63 39.37,68.58 33.97,73.98 33.97,81.6 33.02,82.55 33.02,89.53 32.07,90.49 32.07,94.93 31.43,95.57 31.43,100.65 30.48,101.6 30.48,107 47.94,124.46 47.94,159.7 39.05,168.59 39.05,185.42 53.98,200.34 53.98,234.63 53.66,234.95 53.66,236.54 47.62,242.57 47.62,244.16 39.05,252.73 39.05,278.76 v23.81,294 | v23.5,336.23 22.86,336.23 22.54,336.55 U2.15 | v27.62,340.36 27.62,342.26 18.73,351.15 18.73,355.28 11.43,362.58 11.43,366.08 13.02,367.67 15.24,365.44 ICSP.4
  Bottom 0.508: v27.62,340.36 v23.5,336.23 23.81,336.23 v23.81,294
LED9  (via drill 0.35)
  Top 0.508: R71.1 37.47,75.25 39.37,75.25 Q9.1 39.37,75.56 39.37,77.15 33.97,82.55 33.97,89.53 33.02,90.49 33.02,94.93 32.38,95.57 32.38,100.65 31.43,101.6 31.43,106.68 48.9,124.14 48.9,159.7 40.96,167.64 40.96,171.13 40.64,171.45 40.64,185.74 54.93,200.03 54.93,234.95 v54.61,235.27 | v23.81,338.14 23.18,337.5 U2.16 | ICSP.1 13.02,362.9 25.72,350.2 25.72,349.25 30.16,344.81 v30.16,344.17 30.16,343.85 34.29,339.73 37.47,339.73 40.64,336.55 40.64,333.06 49.53,324.17 50.48,324.17 55.24,319.4 v55.24,308.93 | v54.61,262.25 v54.61,245.43
  Bottom 0.508: v23.81,338.14 24.13,338.14 v30.16,344.17 | v54.61,245.43 v54.61,235.27 | v54.61,262.25 54.61,308.29 v55.24,308.93
LED10  (via drill 0.35)
  Top 0.508: Q10.1 39.37,82.87 37.47,82.87 R78.1 37.47,83.19 37.47,87 33.97,90.49 33.97,94.93 33.34,95.57 33.34,100.65 32.38,101.6 32.38,106.36 49.85,123.83 49.85,159.7 41.91,167.64 41.91,171.13 41.59,171.45 41.59,185.74 55.88,200.03 55.88,235.27 48.58,242.57 48.58,244.16 41.59,251.14 41.59,277.5 v28.57,290.51 | v24.13,339.41 23.18,339.41 U2.17 | v31.11,347.35 31.11,347.66 15.56,363.22 ICSP.3
  Bottom 0.508: v24.13,339.41 24.13,340.36 v31.11,347.35 31.11,343.85 28.57,341.31 v28.57,290.51
LED11  (via drill 0.35)
  Top 0.508: Q11.1 39.37,90.81 37.47,90.81 R85.1 37.15,90.81 v37.15,92.08 | v15.56,337.19 15.88,337.19 17.14,338.45 17.14,341 16.83,341.31 16.83,342.26 16.19,342.9 U2.26 | v40.01,281.62 v11.75,309.88 | v45.4,276.23 46.35,276.23 56.52,266.06 56.52,265.43 59.69,262.25 59.69,242.89 v65.09,237.49 | v51.75,153.67 51.75,121.6 v39.05,108.9
  Bottom 0.508: v15.56,337.19 15.56,336.87 13.34,334.64 13.34,332.11 11.75,330.52 v11.75,309.88 | v45.4,276.23 v40.01,281.62 | v65.09,237.49 65.09,217.17 68.58,213.68 68.58,202.56 66.67,200.66 66.67,190.5 62.23,186.06 62.23,164.15 v51.75,153.67 | v39.05,108.9 35.24,105.09 35.24,93.98 v37.15,92.08
LED12  (via drill 0.35)
  Top 0.508: R92.1 37.47,98.74 39.37,98.74 Q12.1 39.69,99.06 v39.69,100.01 | v14.61,342.9 15.24,342.9 15.56,342.58 U2.27 | v51.75,274.64 v22.86,303.53 | v51.75,245.11 51.75,242.89 62.55,232.09 62.55,206.69 68.58,200.66 68.58,153.99 v67.63,153.03
  Bottom 0.508: v14.61,342.9 14.61,339.73 6.99,332.11 6.99,310.51 18.41,299.08 v22.86,303.53 | v51.75,245.11 v51.75,274.64 | v67.63,153.03 67.63,134.3 40.64,107.31 40.64,100.97 v39.69,100.01
LED13  (via drill 0.35)
  Top 0.508: 39.37,106.68 37.47,106.68 R99.1 | v16.19,340.68 15.24,341.63 U2.28 | v7.94,331.79 7.94,312.42 40.01,280.35 40.01,280.04 42.55,277.5 42.55,251.14 61.59,232.09 61.59,206.38 v67.63,200.34 | v50.8,151.45 50.8,121.92 37.78,108.9 39.37,107.31 39.37,106.68 | 39.37,106.68 Q13.1
  Bottom 0.508: v16.19,340.68 16.19,340.04 v7.94,331.79 | v67.63,200.34 67.63,168.28 v50.8,151.45
N$1  (via drill 0.35)
  Top 0.508: D18.- 50.16,12.38 48.58,13.97 46.99,12.38 D17.- 46.67,12.38 45.09,13.97 43.5,12.38 D16.- 43.18,12.06 42.55,12.7 41.59,11.75 Q2.3 41.91,11.75 42.86,10.79 v43.5,10.79
  Bottom 0.508: 44.61,10 46.35,11.75 46.35,12.06 46.67,12.38 D17.- | 44.61,10 44.45,9.84 v43.5,10.79 43.5,12.06 D16.- | D18.- 50.16,12.06 50.8,11.43 49.53,10.16 48.9,10.16 48.58,9.84 44.77,9.84 44.61,10
N$2  (via drill 3.2 pad 4)
  other vias: 5,365
N$3  (via drill 0.35)
  Top 0.508: 17.94,330.99 19.68,329.25 Y1.1 | 17.94,330.99 17.14,331.79 17.14,333.38 U2.8 | v14.92,326.07 15.24,325.75 15.24,324.8 C2.2 | v17.78,330.83 17.94,330.99
  Bottom 0.508: v14.92,326.07 14.92,327.98 v17.78,330.83
N$4  (via drill 0.35)
  Top 0.508: v17.46,334.64 17.14,334.96 16.51,334.33 U2.7 | v13.65,329.56 13.65,329.25 16.51,326.39 Y1.2 | v20.64,332.11 21.27,331.47 21.27,330.83 C4.2
  Bottom 0.508: v13.65,329.56 17.46,333.38 v17.46,334.64 18.73,335.92 18.73,336.55 19.68,337.5 20.64,336.55 v20.64,332.11
N$5  (via drill 0.35)
  Top 0.508: v15.56,338.14 13.65,340.04 U2.31 | v27.94,349.57 27.94,349.25 30.8,346.39 32.38,346.39 34.92,343.85 R6.2
  Bottom 0.508: v15.56,338.14 16.51,338.14 v27.94,349.57
N$6  (via drill 3.2 pad 4)
  other vias: 35,365
N$7  (via drill 3.2 pad 4)
  other vias: 65,365
N$8  (via drill 3.2 pad 4)
  other vias: 65,305
N$9  (via drill 3.2 pad 4)
  other vias: 35,305
N$10  (via drill 3.2 pad 4)
  other vias: 5,305
N$11  (via drill 3.2 pad 4)
  other vias: 65,245
N$12  (via drill 3.2 pad 4)
  other vias: 35,245
N$13
  Top 0.508: R8.2 48.58,324.17 48.26,324.17 47.62,324.8 46.04,323.21 TX.+
N$14  (via drill 3.2 pad 4)
  other vias: 5,245
N$15  (via drill 3.2 pad 4)
  other vias: 65,185
N$16  (via drill 3.2 pad 4)
  other vias: 35,185
N$17  (via drill 0.35)
  Top 0.508: v42.23,96.84 42.86,96.2 45.09,98.42 D68.+ | v41.27,99.06 45.4,103.19 47.94,103.19 50.48,100.65 58.1,100.65 59.37,99.38 59.37,97.79 58.42,96.84 R86.2
  Bottom 0.508: v42.23,96.84 40.64,98.42 v41.27,99.06
N$18  (via drill 3.2 pad 4)
  other vias: 5,185
N$19  (via drill 3.2 pad 4)
  other vias: 65,125
N$20  (via drill 0.35)
  Top 0.508: R3.2 12.38,325.12 11.11,323.85 R2.1 11.11,323.53 11.11,314.01 v38.42,286.7 66.99,258.13 J2.3 | v67.63,167 67.63,199.07 v59.69,207.01
  Bottom 0.508: v38.42,286.7 4.13,252.41 3.49,252.41 J3.3 | v67.63,167 68.58,166.05 68.58,134.3 41.59,107.31 41.59,100.65 38.1,97.16 38.1,91.76 6.03,59.69 6.03,50.48 4.13,48.58 3.81,48.58 J4.3 | v59.69,207.01 59.69,250.82 66.67,257.81 J2.3
N$21  (via drill 3.2 pad 4)
  other vias: 35,125
N$22  (via drill 3.2 pad 4)
  other vias: 5,125
N$23  (via drill 1.27 pad 1.91)
  other vias: 45.72,271.78
N$24  (via drill 3.2 pad 4)
  other vias: 5,65
N$25  (via drill 3.2 pad 4)
  other vias: 65,5
N$26  (via drill 3.2 pad 4)
  other vias: 35,5
N$27  (via drill 3.2 pad 4)
  other vias: 5,5
N$28
  Top 0.508: D2.+ 45.4,20.32 45.4,20.95 48.58,24.13 50.16,22.54 58.74,22.54 61.91,19.37 61.91,18.73 60.01,16.83 58.42,18.41 R10.2
N$29
  Top 0.508: D3.+ 48.58,20 48.58,19.68 49.53,18.73 52.07,18.73 53.34,17.46 55.24,17.46 56.2,18.41 R11.2
N$30
  Top 0.508: RX.+ 41.91,325.44 43.18,324.17 44.45,324.17 45.72,325.44 R9.2
N$31
  Top 0.508: D4.+ 52.07,20 52.39,20 53.98,18.41 R12.2
N$32
  Bottom 0.508: D5.+ 45.4,20 45.4,18.1 48.26,15.24 50.48,17.46 53.02,17.46 53.98,18.41 R13.2
N$33  (via drill 0.35)
  Top 0.508: v48.26,18.73 48.58,18.73 v50.8,16.51
  Bottom 0.508: v48.26,18.73 48.58,19.05 48.58,20 D6.+ | v50.8,16.51 54.29,16.51 56.2,18.41 R14.2
N$34
  Bottom 0.508: D7.+ 52.07,20.32 52.39,20.32 53.34,21.27 60.01,21.27 60.96,20.32 60.01,19.37 59.37,19.37 58.42,18.41 R15.2
N$35  (via drill 0.35)
  Top 0.508: 42.86,20.32 43.18,20 D5.- 43.5,20 44.77,18.73 45.72,18.73 46.99,20 D6.- 46.99,20.32 48.58,21.91 50.16,20.32 D7.- | 42.86,20.32 42.55,20.64 41.59,19.68 Q1.3 | 42.86,20.32 v44.13,21.59
  Bottom 0.508: 46.67,21.59 46.99,21.27 46.67,20.95 46.67,20.32 D6.- | 46.67,21.59 46.35,21.91 44.45,21.91 v44.13,21.59 43.5,20.95 43.5,20.32 D5.- | 46.67,21.59 47.62,22.54 49.85,20.32 D7.-
N$36  (via drill 0.35)
  Top 0.508: v50.48,30.16 48.9,31.75 45.4,28.26 45.4,27.94 D8.+ | v55.88,30.16 58.74,30.16 59.37,29.53 59.37,27.3 58.42,26.35 R23.2
  Bottom 0.508: v55.88,30.16 v50.48,30.16
N$37
  Top 0.508: D9.+ 48.58,27.62 49.53,26.67 52.07,26.67 53.66,25.08 55.24,25.08 56.2,26.04 R24.2
N$38
  Top 0.508: D10.+ 52.07,27.62 52.7,27.62 53.98,26.35 R25.2
N$39  (via drill 0.35)
  Top 0.508: v46.67,26.35 47.31,26.35 50.16,23.5 v50.48,23.5
  Bottom 0.508: v46.67,26.35 45.4,27.62 D11.+ | v50.48,23.5 51.44,24.45 52.39,24.45 53.98,26.04 R26.2
N$40  (via drill 0.35)
  Top 0.508: v48.26,26.67 48.58,26.67 v51.75,23.5
  Bottom 0.508: v48.26,26.67 48.58,26.99 48.58,27.62 D12.+ | v51.75,23.5 53.66,23.5 56.2,26.04 R27.2
N$41
  Bottom 0.508: D19.+ 51.75,27.62 51.75,26.04 49.53,23.81 49.53,23.18 51.44,21.27 52.39,21.27 53.34,22.23 54.29,22.23 58.1,26.04 R28.2
N$42  (via drill 0.35)
  Top 0.508: 42.7,28.1 43.18,27.62 D11.- 43.5,27.62 45.09,26.04 46.67,27.62 D12.- 46.67,27.94 47.94,29.21 48.9,29.21 49.85,28.26 49.85,27.94 D19.- | 42.7,28.1 42.55,28.26 41.59,27.3 Q3.3 | 42.7,28.1 v44.13,29.53
  Bottom 0.508: 46.51,29.37 46.99,28.89 46.67,28.57 46.67,27.94 D12.- | 46.51,29.37 46.04,29.84 44.45,29.84 v44.13,29.53 43.5,28.89 43.5,27.94 D11.- | 46.51,29.37 47.62,30.48 49.85,28.26 49.85,27.94 D19.-
N$43  (via drill 0.35)
  Top 0.508: v54.61,29.21 52.7,31.11 50.48,31.11 46.99,34.61 46.04,34.61 45.4,35.24 45.4,35.56 D20.+ | v58.42,31.43 58.42,33.97 R30.2
  Bottom 0.508: v54.61,29.21 56.2,29.21 v58.42,31.43
N$44
  Top 0.508: D21.+ 48.58,35.56 49.53,34.61 50.16,34.61 54.29,30.48 54.93,30.48 57.47,33.02 56.52,33.97 R31.2
N$45
  Top 0.508: D22.+ 52.07,35.56 52.7,35.56 53.98,34.29 R32.2
N$46
  Bottom 0.508: D23.+ 45.4,35.56 45.4,34.29 48.58,31.11 50.48,33.02 53.02,33.02 53.98,33.97 R33.2
N$47  (via drill 0.35)
  Top 0.508: v48.58,34.29 48.9,34.29 v51.12,32.07
  Bottom 0.508: v48.58,34.29 48.58,35.56 D24.+ | v51.12,32.07 53.98,32.07 56.2,34.29 R34.2
N$48  (via drill 0.35)
  Top 0.508: v54.61,31.43 v52.07,33.97
  Bottom 0.508: v52.07,33.97 52.07,35.56 D25.+ | v54.61,31.43 55.56,31.43 58.1,33.97 R35.2
N$49  (via drill 0.35)
  Top 0.508: Q4.3 41.59,35.24 42.55,36.2 43.18,35.56 D23.- 43.5,35.88 v44.45,36.83 45.09,37.47 46.67,35.88 D24.- 46.99,35.88 48.58,37.47 50.16,35.88 D25.-
  Bottom 0.508: 45.88,36.67 46.67,35.88 D24.- | 45.88,36.67 45.72,36.83 v44.45,36.83 43.5,35.88 D23.- | 45.88,36.67 47.62,38.42 49.85,36.2 49.85,35.88 D25.-
N$50
  Top 0.508: D26.+ 45.09,43.5 43.81,42.23 44.77,41.27 46.99,41.27 50.16,38.1 51.44,38.1 51.75,37.78 53.98,37.78 58.1,41.91 R37.2
N$51
  Top 0.508: D27.+ 48.58,43.5 48.58,43.18 49.21,42.55 51.12,42.55 52.7,40.96 55.24,40.96 56.2,41.91 R38.2
N$52
  Top 0.508: D28.+ 51.75,43.5 51.75,42.86 52.7,41.91 53.98,41.91 R39.2
N$53  (via drill 0.35)
  Top 0.508: v45.09,42.23 46.99,42.23 50.16,39.05 v50.48,39.05
  Bottom 0.508: v45.09,42.23 45.09,43.5 D29.+ | v50.48,39.05 51.12,39.05 53.98,41.91 R40.2
N$54  (via drill 0.35)
  Top 0.508: v48.26,42.23 48.58,42.23 v52.07,38.73
  Bottom 0.508: v48.26,42.23 48.58,42.55 48.58,43.5 D30.+ | v52.07,38.73 53.02,38.73 56.2,41.91 R41.2
N$55
  Bottom 0.508: D31.+ 52.07,43.81 52.39,43.81 53.34,44.77 59.37,44.77 60.64,46.04 61.28,46.04 62.23,45.09 60.01,42.86 59.37,42.86 58.42,41.91 R42.2
N$56  (via drill 0.35)
  Top 0.508: Q5.3 41.59,43.18 42.55,44.13 43.18,43.5 D29.- 43.5,43.81 44.61,44.93 | D31.- 50.16,43.81 48.58,45.4 46.99,43.81 D30.- 46.67,43.81 45.09,45.4 44.61,44.93 | v43.81,45.09 44.45,45.09 44.61,44.93
  Bottom 0.508: 46.83,44.93 46.99,44.77 46.67,44.45 46.67,43.81 D30.- | 46.83,44.93 46.35,45.4 44.13,45.4 v43.81,45.09 43.5,44.77 43.5,43.81 D29.- | 46.83,44.93 48.58,46.67 50.16,45.09 50.16,43.81 D31.-
N$57
  Top 0.508: D32.+ 45.09,51.44 44.13,50.48 44.45,50.16 44.45,49.85 45.09,49.21 48.26,49.21 50.16,47.31 55.88,47.31 58.1,49.53 R44.2
N$58
  Top 0.508: D33.+ 48.58,51.44 48.58,51.12 49.53,50.16 52.07,50.16 53.34,48.9 55.56,48.9 56.2,49.53 R45.2
N$59
  Top 0.508: D34.+ 52.07,51.44 52.39,51.44 53.98,49.85 R46.2
N$60  (via drill 0.35)
  Top 0.508: v45.4,50.16 48.58,50.16 v50.48,48.26
  Bottom 0.508: v45.4,50.16 45.4,51.44 D35.+ | v50.48,48.26 52.7,48.26 53.98,49.53 R47.2
N$61
  Bottom 0.508: D36.+ 48.58,51.44 48.58,48.9 52.07,45.4 56.2,49.53 R48.2
N$62
  Bottom 0.508: D37.+ 52.07,51.75 52.39,51.75 53.34,52.7 59.37,52.7 61.28,54.61 61.91,54.61 62.87,53.66 60.01,50.8 59.37,50.8 58.42,49.85 R49.2
N$63  (via drill 0.35)
  Top 0.508: Q6.3 41.59,51.12 42.55,52.07 43.18,51.44 D35.- 43.5,51.75 44.61,52.86 | D37.- 50.16,51.75 48.58,53.34 46.99,51.75 D36.- 46.67,51.75 45.09,53.34 44.61,52.86 | v44.77,52.7 44.61,52.86
  Bottom 0.508: 45.88,52.55 46.67,51.75 D36.- | 45.88,52.55 45.72,52.7 v44.77,52.7 43.81,51.75 43.5,51.75 D35.- | 45.88,52.55 46.67,53.34 48.26,53.34 49.85,51.75 D37.-
N$64  (via drill 0.35)
  Top 0.508: v42.23,62.23 45.09,59.37 D38.+ | v40.64,57.47 44.13,57.47 45.4,56.2 47.94,56.2 50.48,53.66 v55.88,53.66 | v58.74,56.52 58.74,57.15 58.42,57.47 R51.2
  Bottom 0.508: v42.23,62.23 40.64,60.64 v40.64,57.47 | v58.74,56.52 v55.88,53.66
N$65  (via drill 0.35)
  Top 0.508: v48.58,61.59 48.58,59.37 D39.+ | v51.44,64.14 52.7,64.14 53.34,63.5 54.61,63.5 55.88,62.23 58.1,62.23 59.37,60.96 59.37,59.37 62.55,56.2 62.55,53.34 61.59,52.39 56.52,57.47 R52.2
  Bottom 0.508: v48.58,61.59 48.9,61.59 v51.44,64.14
N$66
  Top 0.508: D40.+ 52.07,59.05 52.7,59.05 53.98,57.78 R53.2
N$67  (via drill 0.35)
  Top 0.508: v46.04,57.15 48.26,57.15 v50.8,54.61
  Bottom 0.508: v46.04,57.15 45.4,57.78 45.4,59.05 D41.+ | v50.8,54.61 51.12,54.61 53.98,57.47 R54.2
N$68  (via drill 0.35)
  Top 0.508: v49.85,57.78 50.8,57.78 v53.34,55.24
  Bottom 0.508: v49.85,57.78 48.58,59.05 D42.+ | v53.34,55.24 53.98,55.24 56.2,57.47 R55.2
N$69  (via drill 0.35)
  Top 0.508: v51.75,58.1 53.34,56.52 56.2,56.52 v56.52,56.2
  Bottom 0.508: v51.75,58.1 51.75,59.05 D43.+ | v56.52,56.2 56.83,56.2 58.1,57.47 R56.2
N$70  (via drill 0.35)
  Top 0.508: Q7.3 41.59,58.74 42.55,59.69 43.18,59.05 D41.- 43.5,59.05 44.45,58.1 45.09,58.1 45.4,57.78 46.67,59.05 D42.- 46.99,59.05 47.15,58.9 | 47.15,58.9 47.94,58.1 48.26,58.1 48.58,57.78 49.85,59.05 D43.- | v47.31,60.64 47.31,59.05 47.15,58.9
  Bottom 0.508: v47.31,60.64 46.67,61.28 44.45,61.28 43.5,60.33 43.5,59.37 D41.- | v47.31,60.64 46.67,60.01 46.67,59.37 D42.- | v47.31,60.64 47.62,60.96 47.94,60.64 48.9,60.64 49.85,59.69 49.85,59.37 D43.-
N$71  (via drill 0.35)
  Top 0.508: v41.59,60.33 40.01,61.91 45.09,66.99 D44.+ | v58.1,63.82 58.1,65.41 R58.2
  Bottom 0.508: v41.59,60.33 41.59,58.42 45.72,54.29 49.21,54.29 52.7,57.78 52.7,59.69 53.66,60.64 54.93,60.64 v58.1,63.82
N$72  (via drill 0.35)
  Top 0.508: v53.02,61.28 48.58,65.72 48.58,66.99 D45.+ | v56.2,64.45 56.2,65.41 R59.2
  Bottom 0.508: v56.2,64.45 v53.02,61.28
N$73
  Top 0.508: D46.+ 52.07,66.99 52.7,66.99 53.98,65.72 R60.2
N$74  (via drill 0.35)
  Top 0.508: v45.09,65.72 46.04,65.72 v50.16,61.59
  Bottom 0.508: v45.09,65.72 45.09,66.99 D47.+ | v50.16,61.59 53.98,65.41 R61.2
N$75  (via drill 0.35)
  Top 0.508: v47.62,65.41 47.94,65.41 51.75,61.59 v51.75,61.28
  Bottom 0.508: v47.62,65.41 48.58,66.36 48.58,66.99 D48.+ | v51.75,61.28 56.2,65.72 R62.2
N$76  (via drill 0.35)
  Top 0.508: v52.07,65.72 53.34,64.45 54.93,64.45 v56.2,63.18
  Bottom 0.508: v52.07,65.72 52.07,66.99 D49.+ | v56.2,63.18 58.42,65.41 R63.2
N$77  (via drill 0.35)
  Top 0.508: Q8.3 41.59,66.67 42.55,67.63 43.18,66.99 D47.- 43.5,67.31 45.09,68.9 46.67,67.31 D48.- 46.99,67.31 48.58,68.9 50.16,67.31 D49.- 50.16,66.99 v50.16,65.72
  Bottom 0.508: 45.24,64.61 46.67,66.04 46.67,66.99 D48.- | 45.24,64.61 44.77,64.14 43.5,65.41 43.5,66.99 D47.- | D49.- 50.16,66.99 50.8,66.36 v50.16,65.72 49.85,65.41 48.9,65.41 47.94,64.45 45.4,64.45 45.24,64.61
N$78  (via drill 0.35)
  Top 0.508: v57.47,76.52 51.44,76.52 48.9,79.06 45.4,75.56 45.4,75.25 D50.+ | v59.37,76.52 59.37,74.3 58.42,73.34 R65.2
  Bottom 0.508: v59.37,76.52 v57.47,76.52
N$79
  Top 0.508: D51.+ 48.58,74.93 48.58,74.61 49.21,73.98 50.16,73.98 54.29,69.85 54.93,69.85 57.47,72.39 56.52,73.34 R66.2
N$80
  Top 0.508: D52.+ 52.07,74.93 52.7,74.93 53.98,73.66 R67.2
N$81  (via drill 0.35)
  Top 0.508: v45.4,73.03 49.53,73.03 v50.48,72.07
  Bottom 0.508: v45.4,73.03 45.4,74.93 D53.+ | v50.48,72.07 52.7,72.07 53.98,73.34 R68.2
N$82
  Bottom 0.508: D54.+ 48.58,74.93 48.58,71.75 51.44,68.9 56.2,73.66 R69.2
N$83  (via drill 0.35)
  Top 0.508: v54.61,70.8 v52.07,73.34
  Bottom 0.508: v52.07,73.34 52.07,74.93 D55.+ | v54.61,70.8 55.56,70.8 58.1,73.34 R70.2
N$84  (via drill 0.35)
  Top 0.508: 42.86,75.25 43.18,74.93 D53.- 43.5,74.93 44.45,73.98 46.04,73.98 46.99,74.93 D54.- 46.99,75.25 48.58,76.83 50.16,75.25 D55.- | 42.86,75.25 42.55,75.56 41.59,74.61 Q9.3 | 42.86,75.25 v44.13,76.52
  Bottom 0.508: 46.67,76.52 46.99,76.2 46.67,75.88 46.67,75.25 D54.- | 46.67,76.52 46.35,76.83 44.45,76.83 v44.13,76.52 43.5,75.88 43.5,75.25 D53.- | 46.67,76.52 47.62,77.47 49.85,75.25 D55.-
N$85
  Top 0.508: D56.+ 45.4,82.87 45.4,82.55 46.35,81.6 46.99,81.6 48.58,80.01 48.9,80.01 51.44,77.47 54.61,77.47 58.1,80.96 R72.2
N$86
  Top 0.508: D57.+ 48.58,82.87 48.58,82.55 49.53,81.6 52.07,81.6 53.66,80.01 55.24,80.01 56.2,80.96 R73.2
N$87
  Top 0.508: D58.+ 52.07,82.87 52.39,82.87 53.98,81.28 R74.2
N$88
  Bottom 0.508: D59.+ 45.4,83.19 46.99,84.77 51.75,84.77 53.02,83.5 53.02,82.23 53.98,81.28 R75.2
N$89  (via drill 0.35)
  Top 0.508: v48.26,81.6 48.58,81.6 v51.75,78.42
  Bottom 0.508: v48.26,81.6 48.58,81.92 48.58,82.87 D60.+ | v51.75,78.42 53.66,78.42 56.2,80.96 R76.2
N$90
  Bottom 0.508: D61.+ 51.75,82.87 51.75,79.69 50.8,78.74 50.8,78.11 53.02,75.88 58.1,80.96 R77.2
N$91  (via drill 0.35)
  Top 0.508: D61.- 50.16,83.19 48.58,84.77 46.99,83.19 D60.- 46.67,83.19 45.09,84.77 43.5,83.19 D59.- 43.18,82.87 42.55,83.5 41.59,82.55 Q10.3 41.91,82.55 42.86,81.6 v43.5,81.6
  Bottom 0.508: 44.93,80.8 46.99,82.87 D60.- | 44.93,80.8 44.45,80.33 43.5,81.28 v43.5,81.6 43.5,82.87 D59.- | D61.- 50.16,82.87 50.8,82.23 49.53,80.96 48.9,80.96 48.58,80.64 45.09,80.64 44.93,80.8
N$92  (via drill 0.35)
  Top 0.508: v42.23,91.44 42.86,92.08 43.81,92.08 45.09,90.81 D62.+ | v42.23,88.9 44.45,88.9 45.09,88.27 46.99,88.27 47.62,87.63 48.26,87.63 48.58,87.31 51.75,87.31 v53.02,86.04 | v58.74,87.95 58.74,88.58 58.42,88.9 R79.2
  Bottom 0.508: v42.23,88.9 v42.23,91.44 | v53.02,86.04 56.83,86.04 v58.74,87.95
N$93  (via drill 0.35)
  Top 0.508: v50.48,92.71 50.16,93.03 48.58,91.44 48.58,90.81 D63.+ | v51.75,93.98 53.02,93.98 54.61,92.39 58.74,92.39 59.37,91.76 59.37,91.12 60.33,90.17 60.33,88.27 58.74,86.68 56.52,88.9 R80.2
  Bottom 0.508: v51.75,93.98 v50.48,92.71
N$94
  Top 0.508: D64.+ 52.07,90.49 52.7,90.49 53.98,89.22 R81.2
N$95
  Bottom 0.508: D65.+ 45.4,90.49 45.4,88.58 48.26,85.72 50.8,85.72 53.98,88.9 R82.2
N$96  (via drill 0.35)
  Top 0.508: v47.94,88.58 48.26,88.58 48.58,88.27 52.07,88.27 v53.34,87
  Bottom 0.508: v47.94,88.58 48.58,89.22 48.58,90.49 D66.+ | v53.34,87 53.98,87 56.2,89.22 R83.2
N$97  (via drill 0.35)
  Top 0.508: v52.07,89.22 53.34,87.95 v56.2,87.95
  Bottom 0.508: v52.07,89.22 52.07,90.49 D67.+ | v56.2,87.95 57.15,87.95 58.1,88.9 R84.2
N$98  (via drill 0.35)
  Top 0.508: Q11.3 41.59,90.17 42.86,90.17 43.18,90.49 D65.- 43.5,90.81 44.77,89.53 45.09,89.53 45.4,89.22 46.67,90.49 D66.- 46.99,90.49 47.94,89.53 48.26,89.53 48.58,89.22 49.85,90.49 D67.- 50.16,90.49 v51.12,89.53
  Bottom 0.508: D65.- 43.5,90.81 43.5,91.76 44.45,92.71 46.67,92.71 47.31,92.08 46.67,91.44 46.67,90.81 D66.- 46.67,90.49 46.67,88.27 48.26,86.68 v51.12,89.53 50.16,90.49 D67.-
N$99
  Top 0.508: D69.+ 48.58,98.42 48.58,98.11 49.21,97.47 52.07,97.47 53.02,96.52 53.02,96.2 53.34,95.89 55.24,95.89 56.2,96.84 R87.2
N$100
  Top 0.508: D70.+ 52.07,98.42 52.7,98.42 53.98,97.16 R88.2
N$101
  Bottom 0.508: D71.+ 45.4,98.42 45.4,97.16 48.58,93.98 50.48,95.89 51.12,95.89 52.07,94.93 53.98,96.84 R89.2
N$102  (via drill 0.35)
  Top 0.508: v47.94,97.16 47.94,96.52 v51.75,92.71
  Bottom 0.508: v47.94,97.16 48.58,97.79 48.58,98.42 D72.+ | v51.75,92.71 52.07,92.71 56.2,96.84 R90.2
N$103  (via drill 0.35)
  Top 0.508: v54.93,93.34 v52.07,96.2
  Bottom 0.508: v52.07,96.2 52.07,98.42 D73.+ | v54.93,93.34 54.93,93.66 58.1,96.84 R91.2
N$104  (via drill 0.35)
  Top 0.508: Q12.3 41.59,98.11 42.55,99.06 43.18,98.42 D71.- 43.5,98.74 44.61,99.85 | D73.- 50.16,98.74 48.58,100.33 46.99,98.74 D72.- 46.67,98.74 45.09,100.33 44.61,99.85 | v43.81,100.01 44.45,100.01 44.61,99.85
  Bottom 0.508: 46.83,99.85 46.99,99.69 46.67,99.38 46.67,98.74 D72.- | 46.83,99.85 46.35,100.33 44.13,100.33 v43.81,100.01 43.5,99.69 43.5,98.74 D71.- | 46.83,99.85 48.58,101.6 50.16,100.01 50.16,98.74 D73.-
N$105
  Top 0.508: D74.+ 45.4,106.68 45.4,107.31 52.7,114.62 59.37,107.95 59.37,105.73 58.42,104.78 R93.2
N$106
  Top 0.508: D75.+ 48.58,106.36 48.58,106.05 49.53,105.09 52.07,105.09 53.34,103.82 55.56,103.82 56.2,104.46 R94.2
N$107
  Top 0.508: D76.+ 52.07,106.36 52.39,106.36 53.98,104.78 R95.2
N$108  (via drill 0.35)
  Top 0.508: v45.4,104.14 48.26,104.14 v50.8,101.6
  Bottom 0.508: v45.4,104.14 45.4,106.36 D77.+ | v50.8,101.6 53.98,104.78 R96.2
N$109  (via drill 0.35)
  Top 0.508: v48.26,105.09 48.58,105.09 v52.07,101.6
  Bottom 0.508: v48.26,105.09 48.58,105.41 48.58,106.36 D78.+ | v52.07,101.6 53.34,101.6 56.2,104.46 R97.2
N$110
  Bottom 0.508: D79.+ 51.75,106.36 51.75,103.82 49.85,101.92 49.85,101.28 51.44,99.69 53.34,99.69 58.1,104.46 R98.2
N$111  (via drill 0.35)
  Top 0.508: 42.86,106.68 43.18,106.36 D77.- 43.5,106.36 44.77,105.09 45.72,105.09 46.99,106.36 D78.- 46.99,106.68 48.58,108.27 50.16,106.68 D79.- | 42.86,106.68 42.55,107 41.59,106.05 Q13.3 | 42.86,106.68 v44.13,107.95
  Bottom 0.508: 46.67,107.95 46.99,107.63 46.67,107.31 46.67,106.68 D78.- | 46.67,107.95 46.35,108.27 44.45,108.27 v44.13,107.95 43.5,107.31 43.5,106.68 D77.- | 46.67,107.95 47.62,108.9 49.85,106.68 D79.-
N$112  (via drill 1.27 pad 1.91)
  other vias: 45.72,269.24
N$113  (via drill 1.27 pad 1.91)
  other vias: 45.72,266.7
N$114  (via drill 1.27 pad 1.91)
  other vias: 45.72,264.16
N$115  (via drill 1.27 pad 1.91)
  other vias: 45.72,261.62
N$116  (via drill 1.27 pad 1.91)
  other vias: 45.72,259.08
N$117  (via drill 1.27 pad 1.91)
  other vias: 45.72,256.54
N$118  (via drill 1.27 pad 1.91)
  other vias: 48.26,254
N$119  (via drill 1.27 pad 1.91)
  other vias: 48.26,256.54
N$120  (via drill 1.27 pad 1.91)
  other vias: 48.26,259.08
N$121  (via drill 1.27 pad 1.91)
  other vias: 48.26,261.62
N$122  (via drill 1.27 pad 1.91)
  other vias: 48.26,264.16
N$123  (via drill 1.27 pad 1.91)
  other vias: 48.26,266.7
N$124  (via drill 1.27 pad 1.91)
  other vias: 48.26,269.24
N$125  (via drill 1.27 pad 1.91)
  other vias: 48.26,271.78
N$126  (via drill 1.27 pad 1.91)
  other vias: 45.72,274.32
N$127  (via drill 1.27 pad 1.91)
  other vias: 58.42,284.48
N$128  (via drill 1.27 pad 1.91)
  other vias: 58.42,289.56
N$129  (via drill 1.27 pad 1.91)
  other vias: 58.42,292.1
N$130  (via drill 1.27 pad 1.91)
  other vias: 58.42,287.02
N$131  (via drill 1.27 pad 1.91)
  other vias: 60.96,287.02
N$132  (via drill 1.27 pad 1.91)
  other vias: 60.96,289.56
N$133  (via drill 1.27 pad 1.91)
  other vias: 60.96,292.1
N$134  (via drill 1.27 pad 1.91)
  other vias: 60.96,294.64
N$135  (via drill 1.27 pad 1.91)